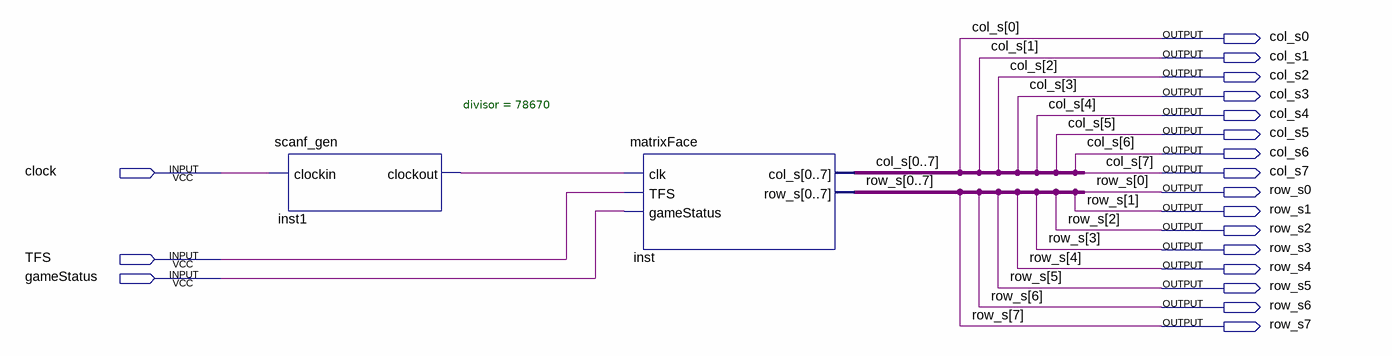
[diagram p0: schematic sheet]
// Quartus schematic genFace.bdf as structural Verilog: 2 symbols, 19 pins
module genFace (
  input  clock,
  input  TFS,
  input  gameStatus,
  output col_s0,
  output col_s1,
  output col_s2,
  output col_s3,
  output col_s4,
  output col_s5,
  output col_s6,
  output col_s7,
  output row_s0,
  output row_s1,
  output row_s2,
  output row_s3,
  output row_s4,
  output row_s5,
  output row_s6,
  output row_s7
);

  wire inst1_clockout;

  scanf_gen #(.divisor(78670)) inst1 (.clockin(clock), .clockout(inst1_clockout));
  matrixFace inst (
    .clk(inst1_clockout), .TFS(TFS), .gameStatus(gameStatus),
    .col_s({col_s0, col_s1, col_s2, col_s3, col_s4, col_s5, col_s6, col_s7}),
    .row_s({row_s0, row_s1, row_s2, row_s3, row_s4, row_s5, row_s6, row_s7}));
endmodule
